# Altium schematic sheet 08_CF_INTERFACE.SchDoc: GAP9Shield
size A3; DrawnBy: Hanna Müller and Victor Kartsch; Organization: Integrated Systems Laboratory; DocumentNumber: 8; Revision: v1.0; SheetNumber: 8; SheetTotal: 9
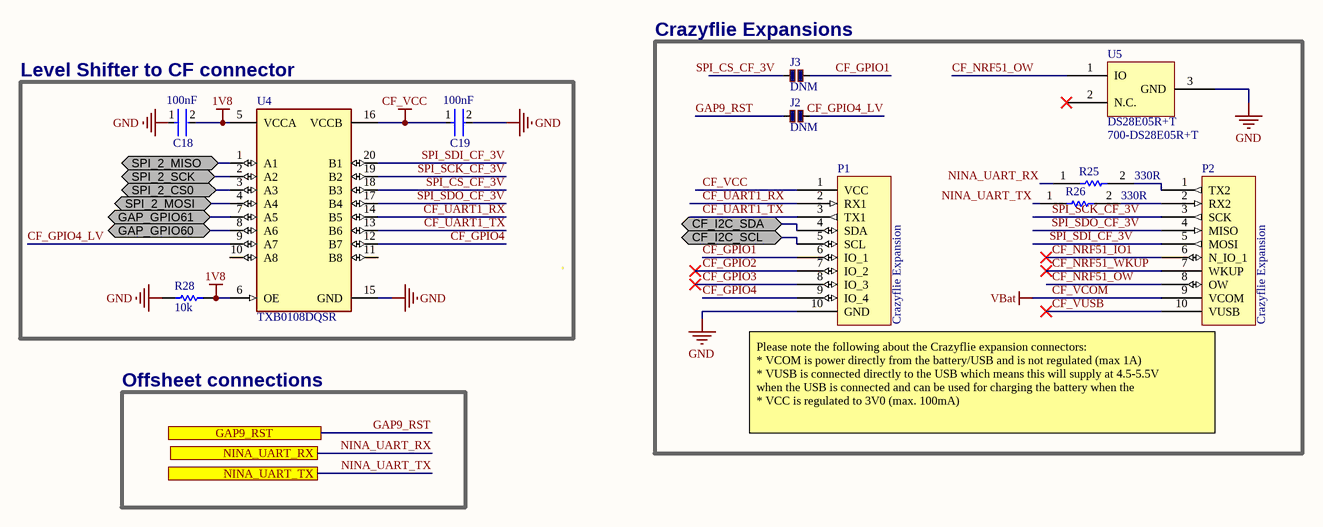
[diagram p0: 08_CF_INTERFACE.SchDoc]

## Parts
C18  value 100nF  [FP-C1005-050-0_05-MFG]  (hidden comment: C1005X5R1E104K050BC)
C19  value 100nF  [FP-C1005-050-0_05-MFG]  (hidden comment: C1005X5R1E104K050BC)
J2  DNM  [Small Solder Jumper]
J3  DNM  [Small Solder Jumper]
P1  Crazyflie Expansion  [CF2-DECK-SMD-HOLES]
P2  Crazyflie Expansion  [CF2-DECK-SMD-HOLES]
R25  value 330R  [H2C/H2R]  (hidden comment: ERJ-H2RD3300X)
R26  value 330R  [H2C/H2R]  (hidden comment: ERJ-H2RD3300X)
R28  value 10k  [RESC0603X28X15LL05T05]  (hidden comment: CRCW020110K0FNED)
U4  TXB0108DQSR  [FP-DQS0020A-MFG]
U5  DS28E05R+T  Supplier Part Number 1: 700-DS28E05R+T  [SOT23-3]

## Blocks framed on the sheet
Crazyflie Expansions: J2 J3 P1 P2 R25 R26 U5
Level Shifter to CF connector: C18 C19 R28 U4

## Ports
CF_I2C_SCL (bidir), CF_I2C_SDA (bidir), GAP9_RST, GAP_GPIO60 (bidir), GAP_GPIO61 (bidir), NINA_UART_RX, NINA_UART_TX, SPI_2_CS0 (bidir), SPI_2_MISO (bidir), SPI_2_MOSI (bidir), SPI_2_SCK (bidir)

## Nets
1V8: C18.2 R28.1 U4.5(VCCA) U4.6(OE)
CF_VCC: C19.1 P1.1(VCC) U4.16(VCCB)
CF_VCOM: P2.9(VCOM)  [also labelled VBat]
GND: C18.1 C19.2 P1.10(GND) R28.2 U4.15(GND) U5.3(GND)
CF_GPIO1: J3.1 P1.6(IO_1)
CF_GPIO2: P1.7(IO_2)
CF_GPIO3: P1.8(IO_3)
CF_GPIO4: P1.9(IO_4) U4.12(B7)
CF_GPIO4_LV: J2.1 U4.9(A7)
CF_I2C_SCL: P1.5(SCL) ; port CF_I2C_SCL
CF_I2C_SDA: P1.4(SDA) ; port CF_I2C_SDA
CF_NRF51_IO1: P2.6(N_IO_1)
CF_NRF51_OW: P2.8(OW) U5.1(IO)
CF_NRF51_WKUP: P2.7(WKUP)
CF_UART1_RX: P1.2(RX1) U4.14(B5)
CF_UART1_TX: P1.3(TX1) U4.13(B6)
CF_VUSB: P2.10(VUSB)
GAP9_RST: J2.2 ; port GAP9_RST
GAP_GPIO60: U4.8(A6) ; port GAP_GPIO60
GAP_GPIO61: U4.7(A5) ; port GAP_GPIO61
NINA_UART_RX: R25.1 ; port NINA_UART_RX
NINA_UART_TX: R26.1 ; port NINA_UART_TX
SPI_2_CS0: U4.3(A3) ; port SPI_2_CS0
SPI_2_MISO: U4.1(A1) ; port SPI_2_MISO
SPI_2_MOSI: U4.4(A4) ; port SPI_2_MOSI
SPI_2_SCK: U4.2(A2) ; port SPI_2_SCK
SPI_CS_CF_3V: J3.2 U4.18(B3)
SPI_SCK_CF_3V: P2.3(SCK) U4.19(B2)
SPI_SDI_CF_3V: P2.5(MOSI) U4.20(B1)
SPI_SDO_CF_3V: P2.4(MISO) U4.17(B4)
NetP2_1: P2.1(TX2) R25.2
NetP2_2: P2.2(RX2) R26.2

Not connected (* = marked no-connect by the designer): U4 10(A8) 11(B8); U5 2(N.C.)*

## Notes on the sheet
- Offsheet connections
- Please note the following about the Crazyflie expansion connectors:
  * VCOM is power directly from the battery/USB and is not regulated (max 1A)
  * VUSB is connected directly to the USB which means this will supply at 4.5-5.5V
  when the USB is connected and can be used for charging the battery when the
  * VCC is regulated to 3V0 (max. 100mA)
- 1
- 2
- 3
- 4
- 5
- 6
- 7
- 8
- A
- B
- C
- D
- Project:
- Date:
- Drawing number:
- Rev:
- Format:
- A3
- Drawn by:
- Laboratory:
- Page
- Sheet:
- of
- File:

## Library data of the parts
C18 C19 = CMP-2000-06000-2: Multilayer Ceramic Capacitors 100nF ±10% 25V X5R SMD 0402; Case Code (Imperial): 0402; Termination: Wraparound; Series: C; Depth: 0.5mm; Voltage Rating (DC): 25V; Contact Plating: Tin; Case Code (Metric): 1005; Dielectric: X5R; Case/Package: 0402; Voltage Rating: 25V; Packaging: Tape and Reel; Thickness: 0.022inch; Dielectric Material: Ceramic; Height: 0.5mm; Weight: 2.3E-05oz; RoHS Compliant: Yes; Width: 0.02inch; Capacitance: 100nF; Tolerance: 10%; Mount: Surface Mount; Package Quantity: 1; Max Operating Temperature: 85°C; Construction: Flat; Min Operating Temperature: -55°C; REACH SVHC: No SVHC; Resistor Type: Ceramic; Length: 1mm; Lead Free: Lead Free; Voltage: 25V
J2 J3 = CMP-00005-5: Technology: SMT
P1 = CF_EXP_LEFT: Supplier 1: Digi-Key; Supplier Part Number 1: 110990442-ND
P2 = CF_EXP_RIGHT: Supplier 1: Digi-Key; Supplier Part Number 1: 110990442-ND
R25 R26 = ERJ-H2RD3300X: Resistor; Manufacturer_Name: Panasonic; Datasheet Link: http://industrial.panasonic.com/cdbs/www-data/pdf/RDQ0000/ast-ind-151033.pdf; Manufacturer_Part_Number: ERJ-H2RD3300X; Mouser Part Number: 667-ERJ-H2RD3300X; Mouser Price/Stock: https://www.mouser.co.uk/ProductDetail/Panasonic/ERJ-H2RD3300X?qs=eP2BKZSCXI6Pijj457e9wg%3D%3D
R28 = CMP-2004-00016-1: Manufacturer: Vishay Dale; Part Number: CRCW020110K0FNED
U4 = CMP-04899-000009-1: IC TRNSLTR BIDIRECTIONAL 20USON; Manufacturer: Texas Instruments; Nominal Supply Current: 0.05-3.5uA; Propagation Delay: 4ns; Max Supply Voltage: 5.5V; V A Min: 1.2V; Max Junction Temp: +150°C; Logic Function Desc: Non-Inverting; Number Of Inputs: 1; V A Max: 3.6V; Number Of Circuits: 8; V B Min: 1.65V; Standoff Height: 0mm; Data Rate: 100Mbits/s; Automotive: No; Mouser Description: Translation - Voltage Levels 8B Bidir Vltg-Level Translator; Category: IC; Temperature Range Low: -40°C; Package: DQS0020A; Manufacturer Part Number: TXB0108DQSR; ComponentLink2Description: Datasheet; Device Class L3: Voltage Level Shifters; Device Class L2: Logic ICs; Temperature Range High: +85°C; Digikey Description: IC TRNSLTR BIDIRECTIONAL 20USON; Octopart: https://octopart.com/txb0108dqsr-texas+instruments-18562890; RoHS: TRUE; Ambient Temperature Range High: +85°C; Lead Free: Yes; V B Max: 5.5V; ComponentLink2URL: https://www.ti.com/lit/ds/symlink/txb0108.pdf; Height: 0.55mm; Ambient Temperature Range Low: -40°C; Temperature: -40°C to +85°C; Number Of Outputs: 1; Min Supply Voltage: 1.2V; Device Class L1: Integrated Circuits (ICs)
U5 = DS28E05R+T: EEPROM 1-Wire 112-BYTE; Supplier 1: Mouser